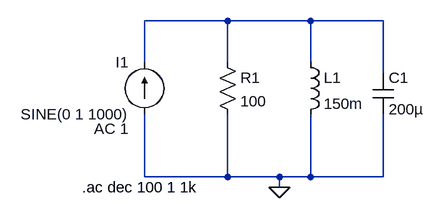
[diagram p0: schematic Parallel Resonance.asc]
Parallel Resonance.asc, the LTspice schematic file:
Version 4
SHEET 1 880 680
WIRE 256 208 128 208
WIRE 384 208 256 208
WIRE 496 208 384 208
WIRE 128 272 128 208
WIRE 256 272 256 208
WIRE 384 272 384 208
WIRE 496 288 496 208
WIRE 128 448 128 352
WIRE 256 448 256 352
WIRE 256 448 128 448
WIRE 336 448 256 448
WIRE 384 448 384 352
WIRE 384 448 336 448
WIRE 496 448 496 352
WIRE 496 448 384 448
WIRE 336 464 336 448
FLAG 336 464 0
SYMBOL current 128 352 R180
WINDOW 0 24 80 Left 2
WINDOW 3 24 0 Left 2
WINDOW 123 24 -22 Left 2
SYMATTR InstName I1
SYMATTR Value SINE(0 1 1000)
SYMATTR Value2 AC 1
SYMBOL res 240 256 R0
SYMATTR InstName R1
SYMATTR Value 100
SYMBOL ind 368 256 R0
SYMATTR InstName L1
SYMATTR Value 150m
SYMBOL cap 480 288 R0
SYMATTR InstName C1
SYMATTR Value 200µ
TEXT 32 464 Left 2 !.ac dec 100 1 1k

The netlist it stands for:
* Parallel Resonance.asc
I1 0 N001 SINE(0 1 1000) AC 1
R1 N001 0 100
L1 N001 0 150m
C1 N001 0 200µ
.ac dec 100 1 1k
.backanno
.end